# Altium schematic sheet Medusa-AI-battery.SchDoc
size Legal; SheetNumber: 1; SheetTotal: 1
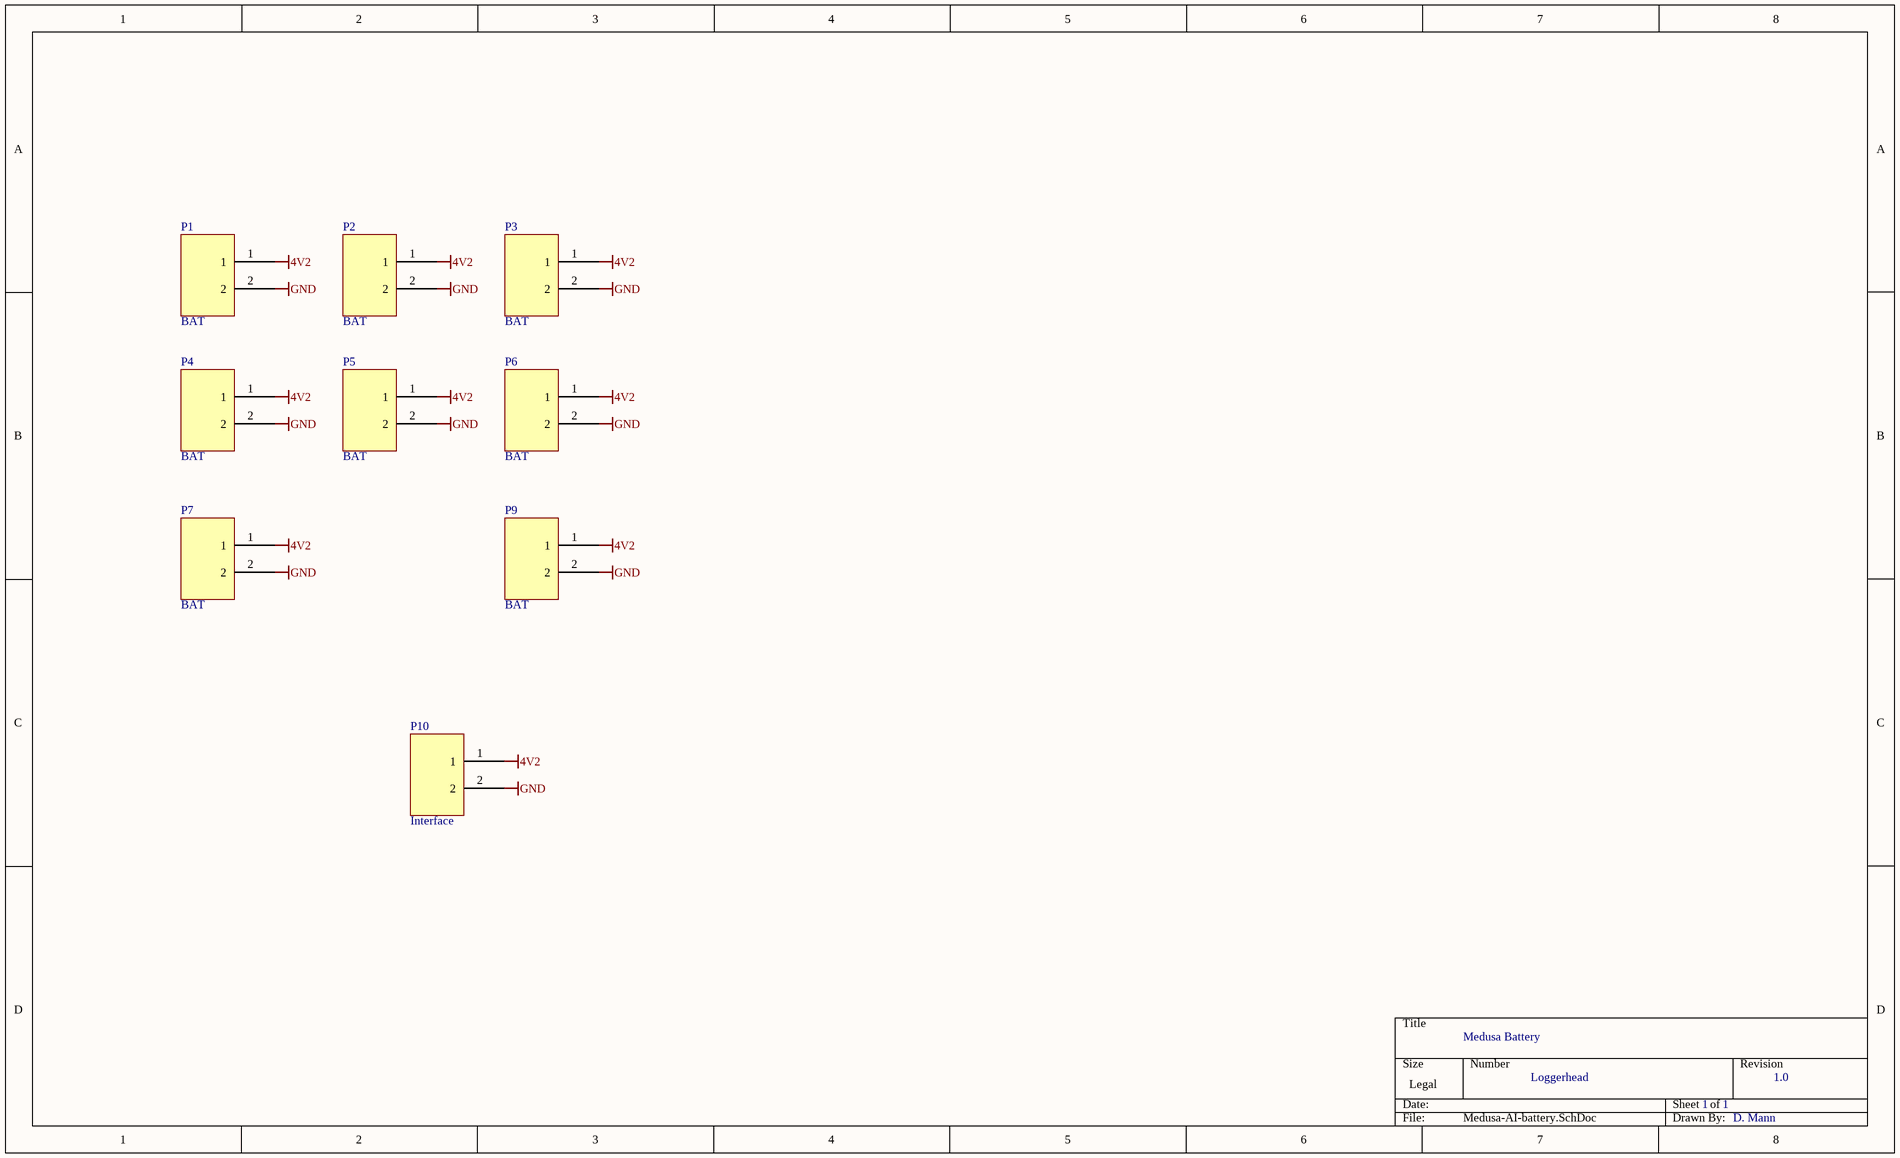
[diagram p0: Medusa-AI-battery.SchDoc]

## Parts
P1  BAT  [HDR_2x1_2mm]
P2  BAT  [HDR_2x1_2mm]
P3  BAT  [HDR_2x1_2mm]
P4  BAT  [HDR_2x1_2mm]
P5  BAT  [HDR_2x1_2mm]
P6  BAT  [HDR_2x1_2mm]
P7  BAT  [HDR_2x1_2mm]
P9  BAT  [HDR_2x1_2mm]
P10  Interface  [HDR_2x1_2mm]

## Nets
4V2: P1.1 P2.1 P3.1 P4.1 P5.1 P6.1 P7.1 P9.1 P10.1
GND: P1.2 P2.2 P3.2 P4.2 P5.2 P6.2 P7.2 P9.2 P10.2

## Notes on the sheet
- Medusa Battery
- Loggerhead
- 1
- 1.0
- D. Mann

## Library data of the parts
P1-P7 P9 P10 = HDR_2x1_2mm